# EAGLE schematic Final_NOEC_KosikC (EAGLE 9.3.0)
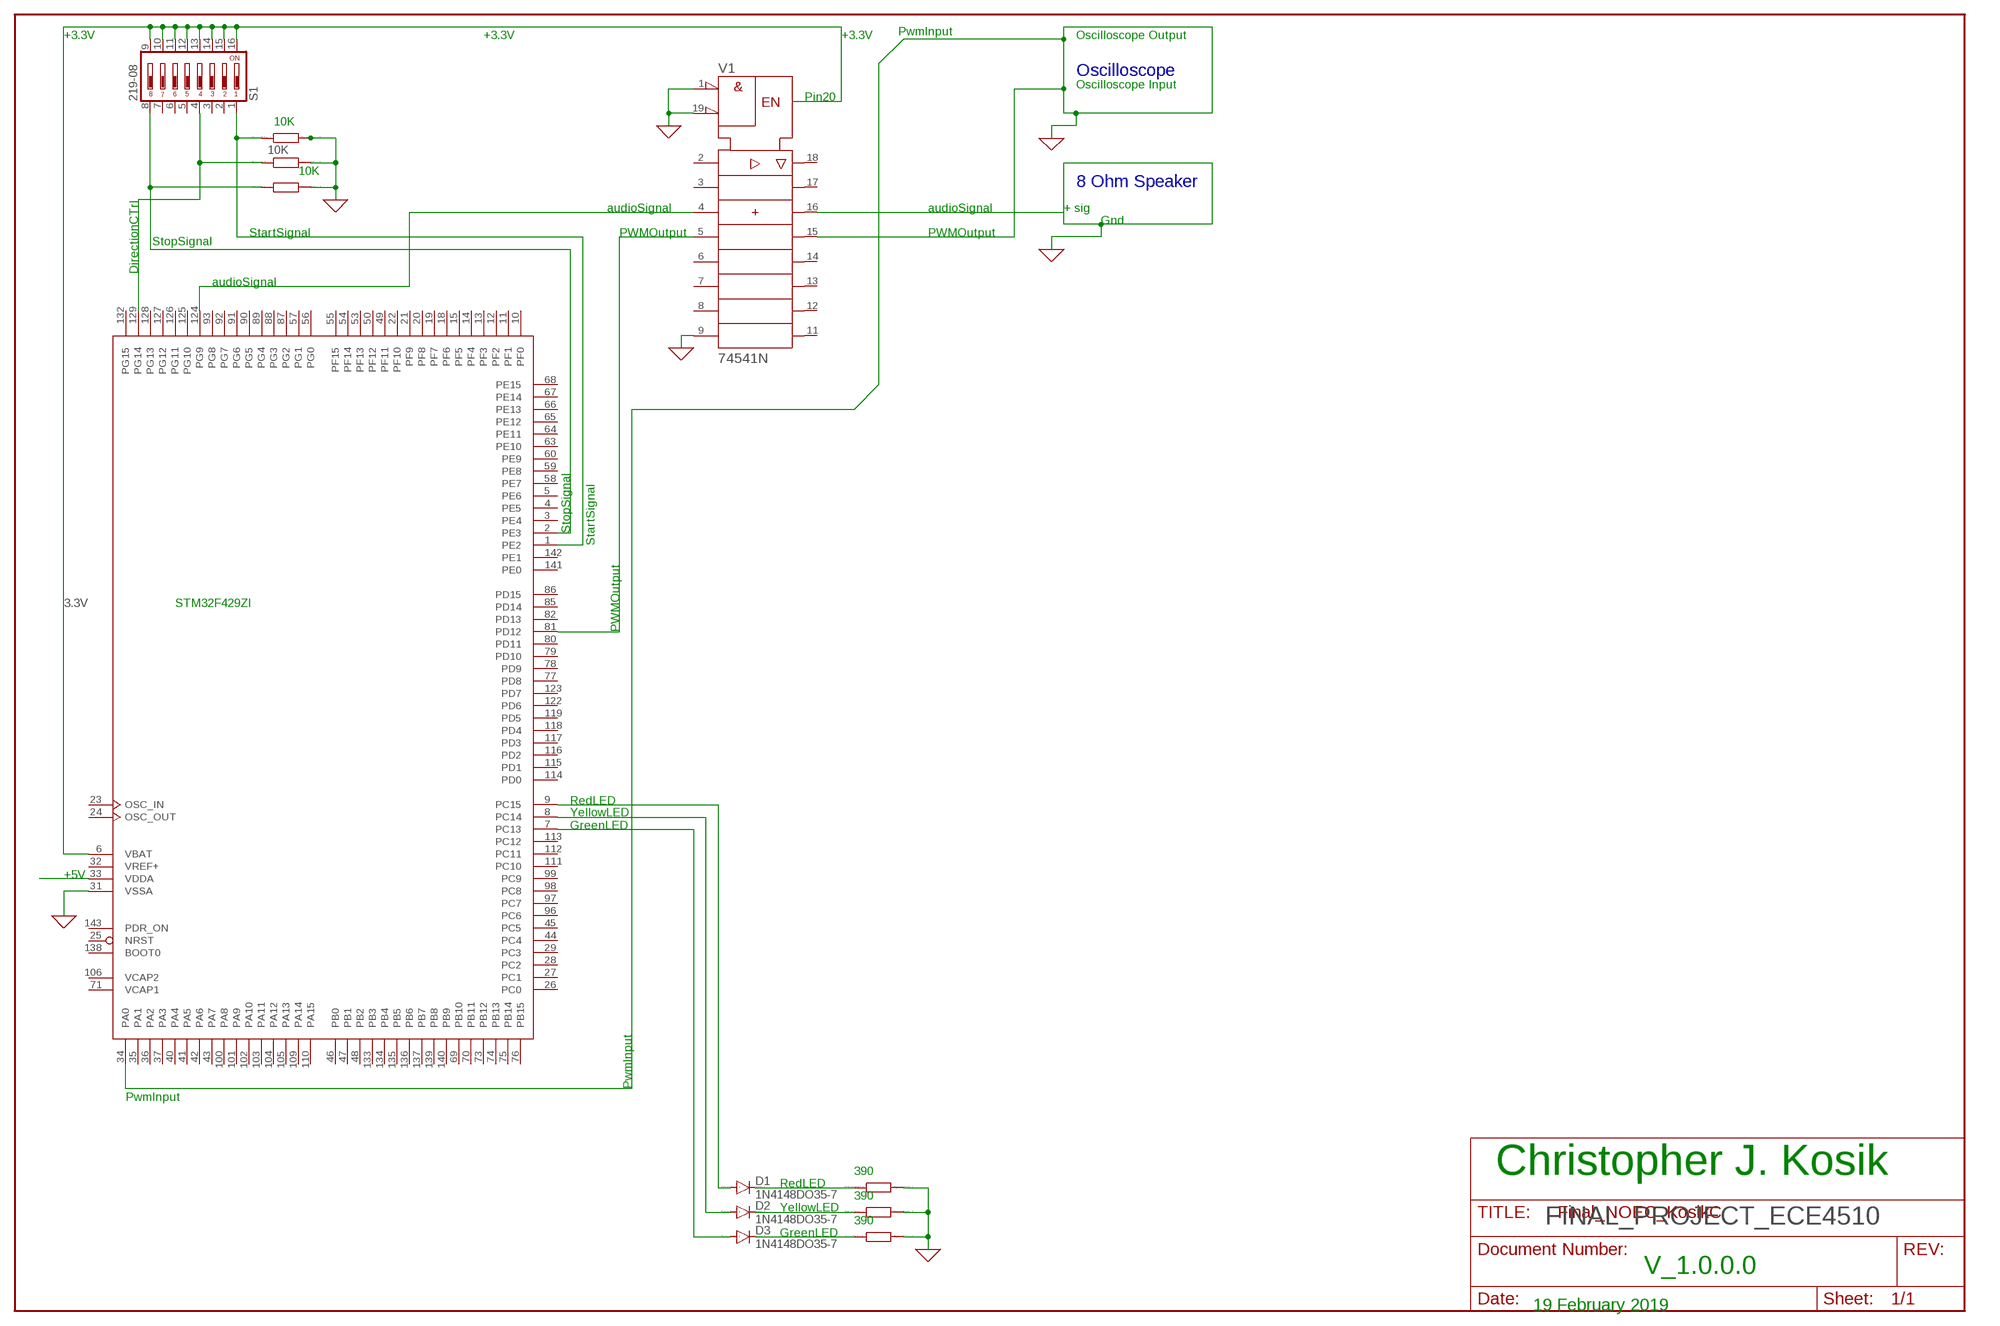
[diagram p0: schematic, sheet 1]

## Parts
D1  1N4148DO35-7  [DO35-7]
D2  1N4148DO35-7  [DO35-7]
D3  1N4148DO35-7  [DO35-7]
IC1  STM32F429ZGT  [LQFP144]
R1  10K  R  [R0805]
R2  R  [R0805]
R3  R  [R0805]
R4  R  [R0805]
R5  R  [R0805]
R6  R  [R0805]
S1  219-08  [CTS-219-08]
V1  74541N  [DIL20]

## Nets
0: IC1.31(VSSA) IC1.34(PA0) R1.2 R2.2 R3.2 R4.2 R5.2 R6.2 V1.1(!G1) V1.9(A8) V1.15(Y4) V1.16(Y3) V1.19(!G2) ; supply symbol labelled GND
3.3V: IC1.6(VBAT) S1.9 S1.10 S1.11 S1.12 S1.13 S1.14 S1.15 S1.16
N$1: D3.A IC1.7(PC13)
N$2: D2.A IC1.8(PC14)
N$3: IC1.1(PE2) R1.1 S1.1
N$4: IC1.2(PE3) R3.1 S1.8
N$5: D1.A IC1.9(PC15)
N$6: D1.C R4.1
N$7: D2.C R5.1
N$8: D3.C R6.1
N$9: IC1.124(PG9) V1.4(A3)
N$12: IC1.33(VDDA)
N$13: IC1.81(PD12) V1.5(A4)
N$14: IC1.129(PG14) R2.1 S1.4
Unconnected: IC1.3(PE4) IC1.4(PE5) IC1.5(PE6) IC1.10(PF0) IC1.11(PF1) IC1.12(PF2) IC1.13(PF3) IC1.14(PF4) IC1.15(PF5) IC1.18(PF6) IC1.19(PF7) IC1.20(PF8) IC1.21(PF9) IC1.22(PF10) IC1.23(OSC_IN) IC1.24(OSC_OUT) IC1.25(NRST) IC1.26(PC0) IC1.27(PC1) IC1.28(PC2) IC1.29(PC3) IC1.35(PA1) IC1.36(PA2) IC1.37(PA3) IC1.40(PA4) IC1.41(PA5) IC1.42(PA6) IC1.43(PA7) IC1.44(PC4) IC1.45(PC5) IC1.46(PB0) IC1.47(PB1) IC1.48(PB2) IC1.49(PF11) IC1.50(PF12) IC1.53(PF13) IC1.54(PF14) IC1.55(PF15) IC1.56(PG0) IC1.57(PG1) IC1.58(PE7) IC1.59(PE8) IC1.60(PE9) IC1.63(PE10) IC1.64(PE11) IC1.65(PE12) IC1.66(PE13) IC1.67(PE14) IC1.68(PE15) IC1.69(PB10) IC1.70(PB11) IC1.73(PB12) IC1.74(PB13) IC1.75(PB14) IC1.76(PB15) IC1.77(PD8) IC1.78(PD9) IC1.79(PD10) IC1.80(PD11) IC1.82(PD13) IC1.85(PD14) IC1.86(PD15) IC1.87(PG2) IC1.88(PG3) IC1.89(PG4) IC1.90(PG5) IC1.91(PG6) IC1.92(PG7) IC1.93(PG8) IC1.96(PC6) IC1.97(PC7) IC1.98(PC8) IC1.99(PC9) IC1.100(PA8) IC1.101(PA9) IC1.102(PA10) IC1.103(PA11) IC1.104(PA12) IC1.105(PA13) IC1.109(PA14) IC1.110(PA15) IC1.111(PC10) IC1.112(PC11) IC1.113(PC12) IC1.114(PD0) IC1.115(PD1) IC1.116(PD2) IC1.117(PD3) IC1.118(PD4) IC1.119(PD5) IC1.122(PD6) IC1.123(PD7) IC1.125(PG10) IC1.126(PG11) IC1.127(PG12) IC1.128(PG13) IC1.132(PG15) IC1.133(PB3) IC1.134(PB4) IC1.135(PB5) IC1.136(PB6) IC1.137(PB7) IC1.138(BOOT0) IC1.139(PB8) IC1.140(PB9) IC1.141(PE0) IC1.142(PE1) IC1.143(PDR_ON) S1.2 S1.3 S1.5 S1.6 S1.7 V1.2(A1) V1.3(A2) V1.6(A5) V1.7(A6) V1.8(A7) V1.11(Y8) V1.12(Y7) V1.13(Y6) V1.14(Y5) V1.17(Y2) V1.18(Y1)

## Notes on the sheet
- PwmInput
- +3.3V | +3.3V | +3.3V | Oscilloscope Output
- Oscilloscope
- Oscilloscope Input
- Pin20
- 10K
- 10K
- 8 Ohm Speaker
- audioSignal | audioSignal | + sig
- Gnd
- StopSignal | StartSignal | PWMOutput | PWMOutput
- DirectionCTrl
- audioSignal
- StopSignal
- StartSignal
- STM32F429ZI
- PWMOutput
- RedLED
- GreenLED | YellowLED
- +5V
- PwmInput
- PwmInput
- 390 | Christopher J. Kosik
- RedLED
- 390
- YellowLED | 390
- GreenLED
- V_1.0.0.0
- 19 February 2019

## Power pins joined to a net without a drawn wire
+UB: V1.20(+UB)
-UB: V1.10(-UB)
VCAP1: IC1.71(VCAP1)
VCAP2: IC1.106(VCAP2)
VDD: IC1.17(VDD) IC1.30(VDD) IC1.39(VDD) IC1.52(VDD) IC1.62(VDD) IC1.72(VDD) IC1.84(VDD) IC1.95(VDD) IC1.108(VDD) IC1.121(VDD) IC1.131(VDD) IC1.144(VDD)
VREF+: IC1.32(VREF+)
VSS: IC1.16(VSS) IC1.38(VSS) IC1.51(VSS) IC1.61(VSS) IC1.83(VSS) IC1.94(VSS) IC1.107(VSS) IC1.120(VSS) IC1.130(VSS)

## Library data of the parts
D1-D3 = diode:1N4148: DIODE high speed (Philips)
IC1 = micro-stm:STM32F429Z*T: ARM 32-bit Cortex™-M3 CPU 180 MHz maximum frequency 1024 to 2048 Kbytes of Flash memory 256 kbytes of SRAM 114 GPIOs 1.8 to 3.6 V application supply
R1-R6 = eagle-ltspice:R: RESISTOR, European symbol; SPICEMODEL: NONE; SPICEPREFIX: R
S1 = switch-dil:219-08*: Surface Mount DIP Switch Series 219 SMT CTS Electronic Components Sourc: www.ctscorp.com; OC_FARNELL: unknown; OC_NEWARK: unknown
V1 = 74ttl-din:74*541: Octal BUFFER and LINE DRIVER, 3-state